# EAGLE design DOT-zero-SHIM (EAGLE 9.6.2)
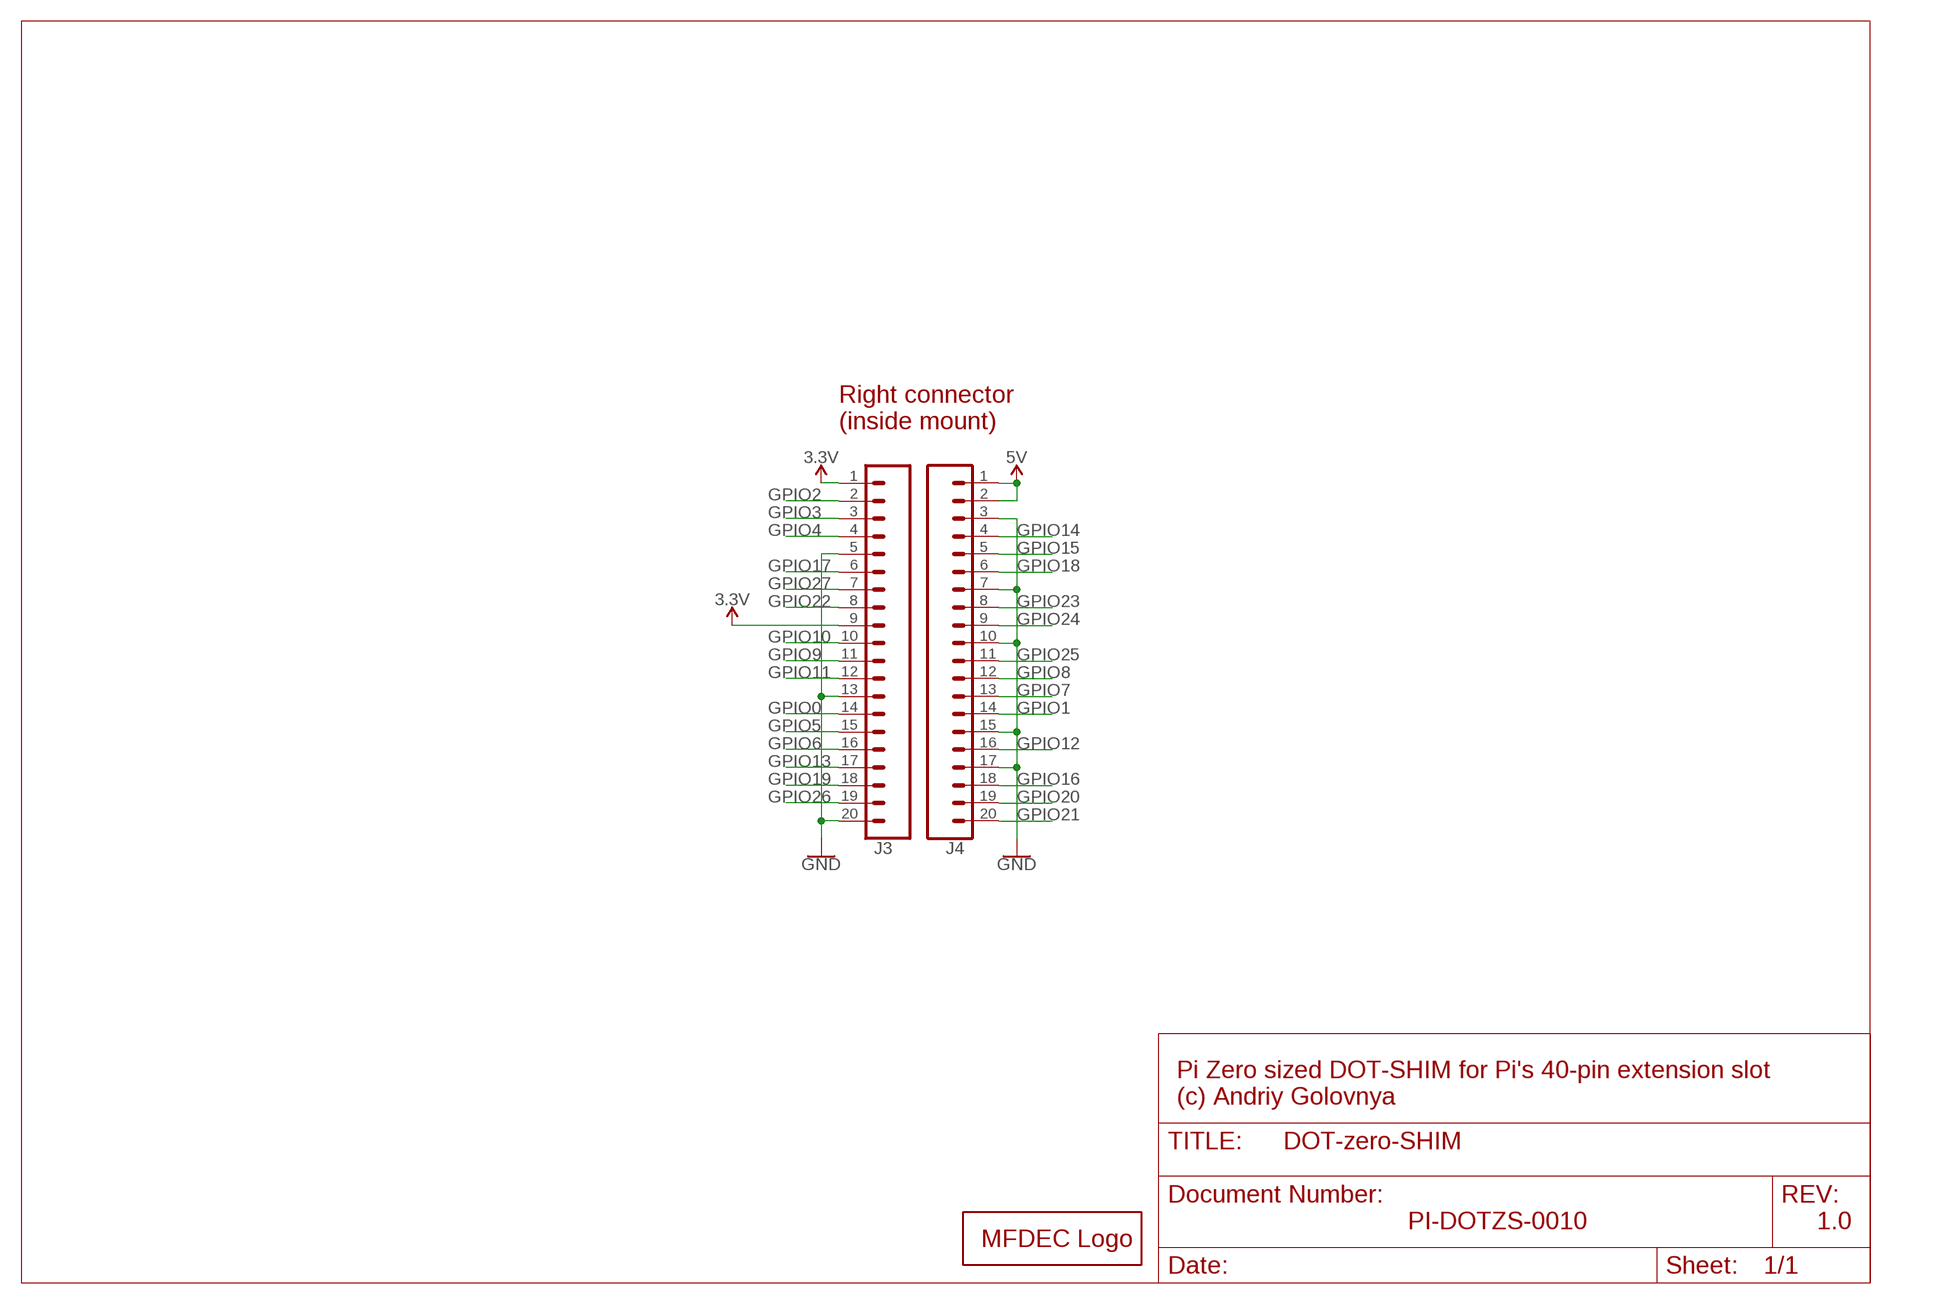
[diagram p0: schematic, sheet 1]

## Parts
J3  CONN_20LOCK  [1X20_LOCK]
J4  CONN_20LOCK  [1X20_LOCK]
LOGO1  MFDECLOGO_L_30MM  [MFDEC_L_30MM]

## Nets
3.3V: J3.1 J3.9
5V: J4.1 J4.2
GND: J3.5 J3.13 J3.20 J4.3 J4.7 J4.10 J4.15 J4.17
GPIO0: J3.14
GPIO1: J4.14
GPIO2: J3.2
GPIO3: J3.3
GPIO4: J3.4
GPIO5: J3.15
GPIO6: J3.16
GPIO7: J4.13
GPIO8: J4.12
GPIO9: J3.11
GPIO10: J3.10
GPIO11: J3.12
GPIO12: J4.16
GPIO13: J3.17
GPIO14: J4.4
GPIO15: J4.5
GPIO16: J4.18
GPIO17: J3.6
GPIO18: J4.6
GPIO19: J3.18
GPIO20: J4.19
GPIO21: J4.20
GPIO22: J3.8
GPIO23: J4.8
GPIO24: J4.9
GPIO25: J4.11
GPIO26: J3.19
GPIO27: J3.7

## Notes on the sheet
- Right connector
  (inside mount)
- Pi Zero sized DOT-SHIM for Pi's 40-pin extension slot
  (c) Andriy Golovnya
- PI-DOTZS-0010 | 1.0

## Library data of the parts
J3 J4 = _my_locked_connectors:CONN_20: Multi connection point. Often used as Generic Header-pin footprint for 0.1 inch spaced/style header connections On any of the 0.1 inch spaced packages, you can populate with these: Break Away Headers - Straight <https://www.sparkfun.com/products/116> (PRT-00116) Break Away Male Headers - Right Angle <https://www.sparkfun.com/products/553> (PRT-00553) Female Headers <https://www.sparkfun.com/products/115> (PRT-00115) Break Away Headers - Machine Pin <https://www.sparkfun.com/products/117> (PRT-00117) Break Away Female Headers - Swiss Machine Pin <https://www.sparkfun.com/products/743> (PRT-00743) For SCREWTERMINALS and SPRING TERMINALS visit here: Screw Terimnals on SparkFun.com <https://www.sparkfun.com/search/results?term=Screw+Terminals> (5mm/3.5mm/2.54mm spacing) This device is also useful as a general connection point to wire up your design to another part of your project. Our various solder wires solder well into these plated through hole pads. Hook-Up Wire - Assortment (Stranded, 22 AWG) <https://www.sparkfun.com/products/11375> (PRT-11375) Hook-Up Wire - Assortment (Solid Core, 22 AWG) <https://www.sparkfun.com/products/11367> (PRT-11367) View the entire wire category on our website here <https://www.sparkfun.com/categories/141> Special notes: Molex polarized connector foot print use with SKU : PRT-08231 with associated crimp pins and housings. 1MM SMD Version SKU: PRT-10208 NOTES ON THE VARIANTS LOCK and LOCK_LONGPADS... This footprint was designed to help hold the alignment of a through-hole component (i.e. 6-pin header) while soldering it into place. You may notice that each hole has been shifted either up or down by 0.005 of an inch from it's more standard position (which is a perfectly straight line). This slight alteration caused the pins (the squares in the middle) to touch the edges of the holes. Because they are alternating, it causes a "brace" to hold the component in place. 0.005 has proven to be the perfect amount of "off-center" position when using our standard breakaway headers. Although looks a little odd when you look at the bare footprint, once you have a header in there, the alteration is very hard to notice. Also,if you push a header all the way into place, it is covered up entirely on the bottom side. Note about LOCK SPECIAL package: This is just like the LOCK variant in that the holes are staggared by 5 mil, but except for the last two holes. They are not altered from the "standard" footprint layout. This is used for a special purpose on the layout of our Graphic LCD Backpack. Make sure you want to use this device before selecting it for you project!
LOGO1 = _my_logos:MFDECLOGO: Midnight Fog - Digital Eye Candy LOGO

## Board
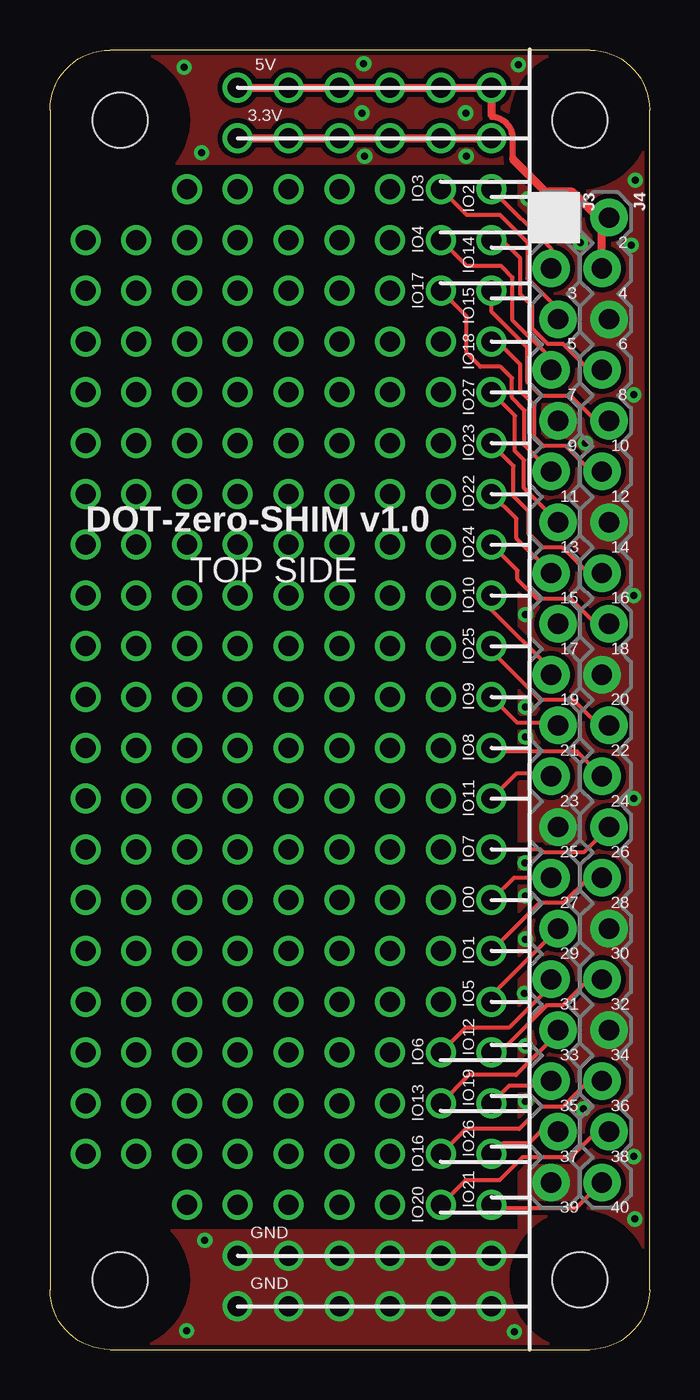
[diagram p1: board, top side]
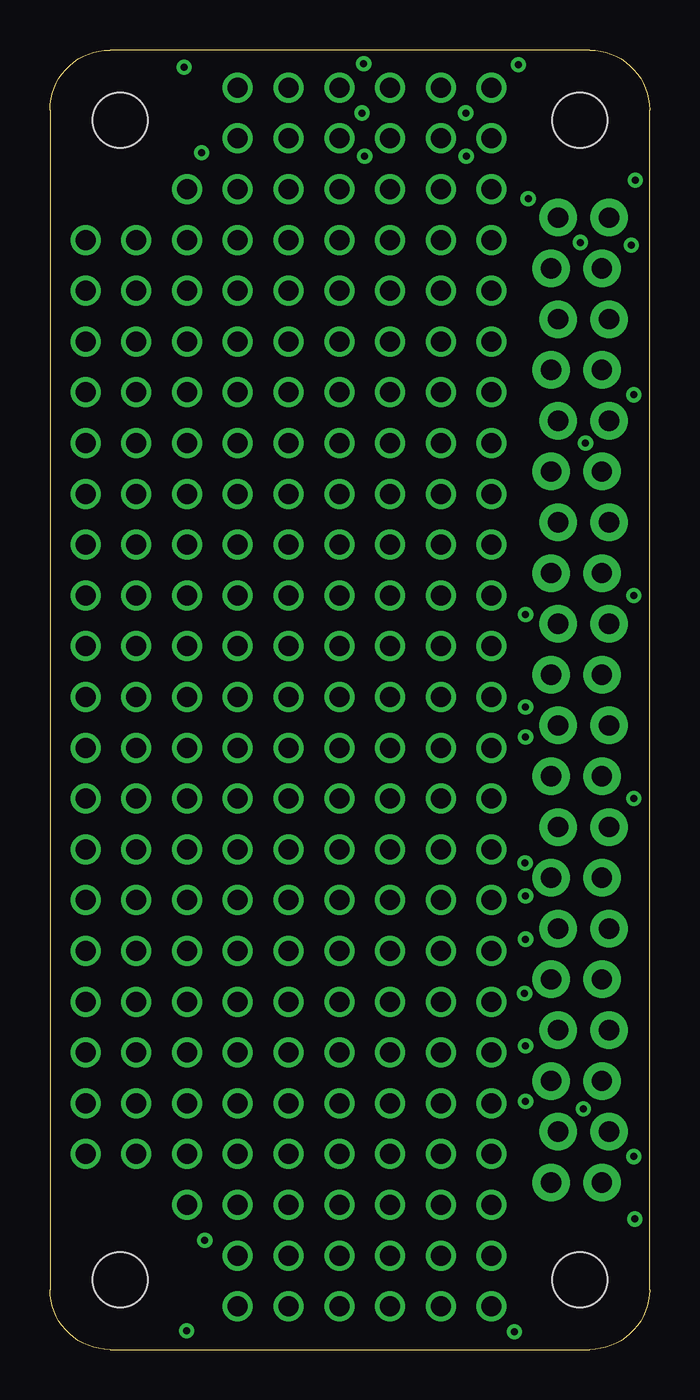
[diagram p2: board, inner layer Route2]
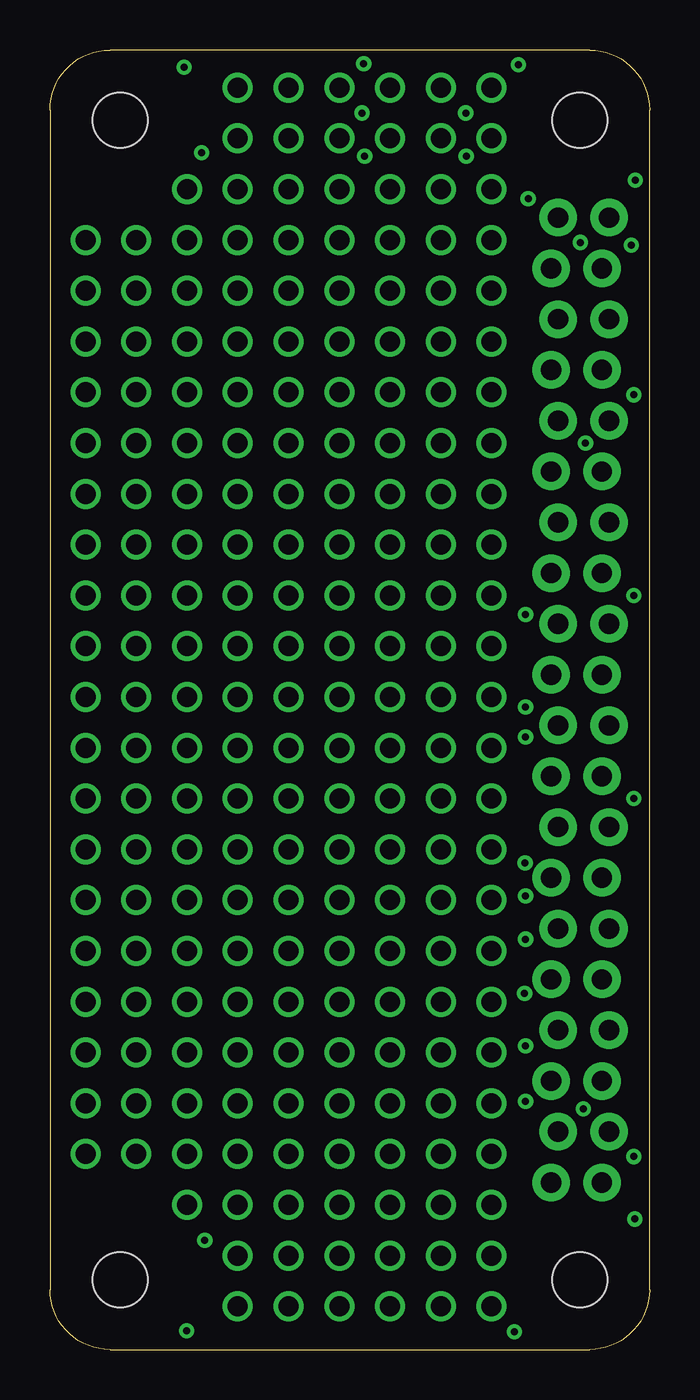
[diagram p3: board, inner layer Route15]
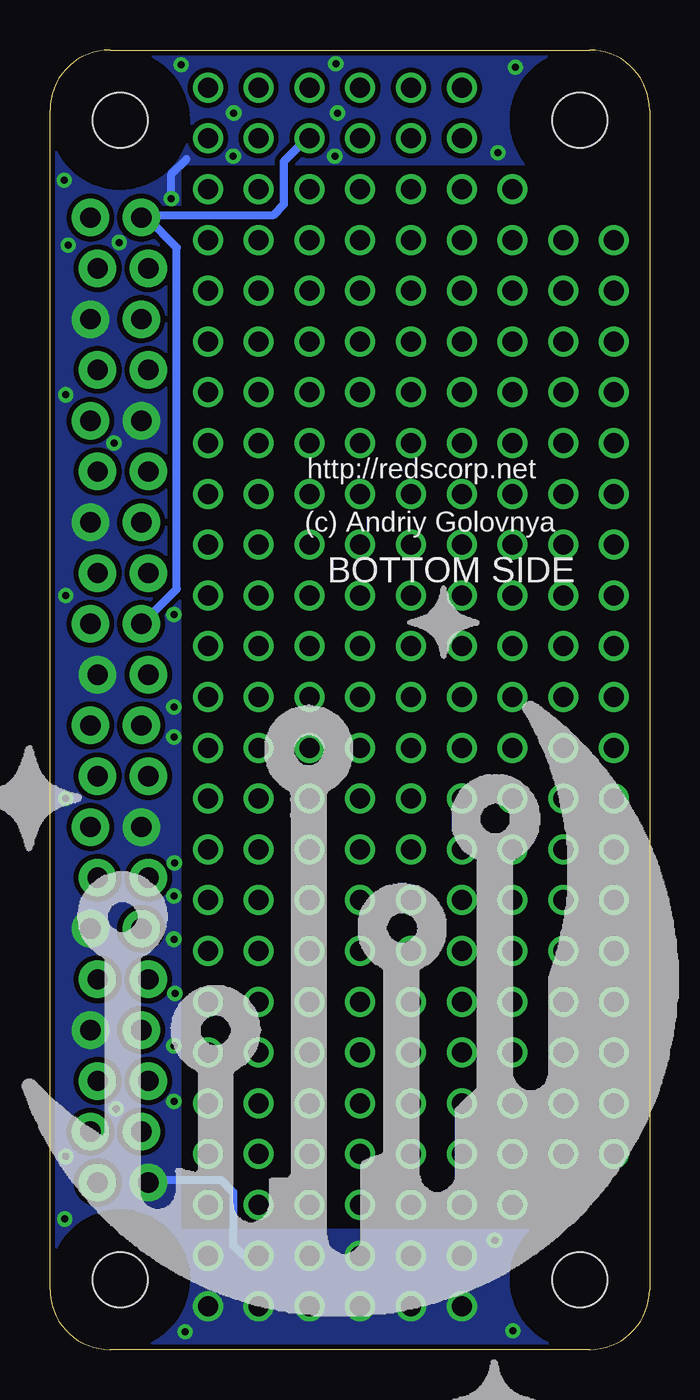
[diagram p4: board, bottom side, seen from below]

Size 30 x 65 mm. Coordinates in mm from the lower left corner, seen from the top.
Outline: 3,0 27,0 arc90 30,3 30,62 arc90 27,65 3,65 arc90 0,62 0,3 arc90 3,0
Copper layers (1*16): Top 0.035mm / dielectric 1.5mm / Bottom 0.035mm
Design rules "default *": minimum track width 6mil, minimum drill 0.35mm, track to track 6mil, track to pad 6mil, pad to pad 6mil, via to via 6mil, smd to smd 6mil, copper to edge 6mil, drill to drill 6mil, minimum pad ring 10mil, minimum via ring 8mil, stop-mask expansion 4mil, vias tented up to drill 20mil, thermal gap 10mil
Holes 2.75 mm at 3.5,3.5 26.5,3.5 3.5,61.5 26.5,61.5

### Footprints (pad centres in the part's own frame; a part is rotated, then mirrored left to right if it is on the bottom)
1X20_LOCK = drill 1.016 pad 1.88: 1 0,0.178; 2 2.54,-0.178; 3 5.08,0.178; 4 7.62,-0.178; 5 10.16,0.178; 6 12.7,-0.178; 7 15.24,0.178; 8 17.78,-0.178; 9 20.32,0.178; 10 22.86,-0.178; 11 25.4,0.178; 12 27.94,-0.178; 13 30.48,0.178; 14 33.02,-0.178; 15 35.56,0.178; 16 38.1,-0.178; 17 40.64,0.178; 18 43.18,-0.178; 19 45.72,0.178; 20 48.26,-0.178

### Placement (x,y rotation side)
J3  25.25,56.62 270 top
J4  27.79,56.62 270 top
LOGO1  -4.19,-7.11 90 bottom  (outside the outline)

### Tracks (layer width: path | path; a pad name or v marks a point on that pad's centre or on a via)
3.3V  (via drill 1)
  Top 0.406: v9.4,60.58 v11.94,60.58 v14.48,60.58 v17.02,60.58 v19.56,60.58 v22.1,60.58
  Bottom 0.406: J3.9 25.4,36.3 23.65,38.04 23.65,55.12 25.15,56.62 J3.1 25.3,56.74 18.82,56.74 18.29,57.28 18.29,59.44 17.14,60.58 v17.02,60.58
5V  (via drill 1)
  Top 0.305: 23.16,59.54 23.16,60.58 arc90 22.1,61.65 22.1,61.75
  Top 0.406: v9.4,63.12 v11.94,63.12 v14.48,63.12 v17.02,63.12 v19.56,63.12 v22.1,63.12 22.1,61.75 | J4.2 27.62,56.26 J4.1 27.44,56.62 26.14,57.91 24.79,57.91 23.16,59.54
GND  (via drill 0.35, 1)
  Bottom 0.406: J3.20 24.95,8.48 21.44,8.48 20.83,7.87 20.83,5.21 20.32,4.7 v19.56,4.7 | v23.93,57.56 23.93,58.78 23.16,59.54
  other vias: 22.1,4.7 17.02,4.7 14.48,4.7 11.94,4.7 9.4,4.7 9.4,2.16 11.94,2.16 14.48,2.16 17.02,2.16 19.56,2.16 22.1,2.16 7.75,5.46 6.83,0.94 29.26,6.53 23.24,0.89 7.59,59.87 6.71,64.14 23.44,64.26 29.29,58.5 20.83,59.69 20.8,61.85 15.75,59.69 15.62,61.85 15.7,64.31 23.8,36.75 23.8,30.63 23.8,22.68 23.8,20.52 23.8,15.19 26.54,55.37 26.8,45.34 26.7,12.04 29.08,55.24 29.21,47.75 29.21,37.72 29.21,27.56 29.21,9.65 23.8,32.13 23.77,24.33 23.75,17.81 23.8,12.42
  pour Top (isolate 0.254, no thermals): 23.5,59.31 0,59.31 0,65.15 30.23,65.15 30.23,0 0,0 0,5.97 23.5,5.97
  pour Bottom (isolate 0.254, no thermals): 0,59.31 0,65.15 30.23,65.15 30.23,0 0,0 0,5.97 23.5,5.97 23.5,59.31
GND1
  cutout Top: 26.5,0 arc-180 26.5,7 arc-180
  cutout Route2: 26.5,0 arc-180 26.5,7 arc-180
  cutout Route15: 26.5,0 arc-180 26.5,7 arc-180
  cutout Bottom: 26.5,0 arc-180 26.5,7 arc-180
GND2
  cutout Top: 3.5,58 arc-180 3.5,65 arc-180
  cutout Route2: 3.5,58 arc-180 3.5,65 arc-180
  cutout Route15: 3.5,58 arc-180 3.5,65 arc-180
  cutout Bottom: 3.5,58 arc-180 3.5,65 arc-180
GND3
  cutout Top: 26.5,58 arc-180 26.5,65 arc-180
  cutout Route2: 26.5,58 arc-180 26.5,65 arc-180
  cutout Route15: 26.5,58 arc-180 26.5,65 arc-180
  cutout Bottom: 26.5,58 arc-180 26.5,65 arc-180
GND4
  cutout Top: 3.5,0 arc-180 3.5,7 arc-180
  cutout Route2: 3.5,0 arc-180 3.5,7 arc-180
  cutout Route15: 3.5,0 arc-180 3.5,7 arc-180
  cutout Bottom: 3.5,0 arc-180 3.5,7 arc-180
GPIO0  (via drill 1)
  Top 0.203: J3.14 23.21,23.59 v22.1,22.48
GPIO1  (via drill 1)
  Top 0.203: J4.14 26.96,23.59 25.69,22.33 24.49,22.33 v22.1,19.94
GPIO2  (via drill 1)
  Top 0.203: v22.1,58.04 25.08,55.06 J3.2
GPIO3  (via drill 1)
  Top 0.203: v19.56,58.04 20.84,56.76 22.51,56.76 23.88,55.39 23.88,53.58 25.43,52.03 J3.3
GPIO4  (via drill 1)
  Top 0.203: J3.4 25.08,49.55 23.15,51.48 23.15,53.62 22.57,54.19 20.87,54.19 v19.56,55.5
GPIO5  (via drill 1)
  Top 0.203: J3.15 22.1,17.72 v22.1,17.4
GPIO6  (via drill 1)
  Top 0.203: J3.16 25.08,18.21 22.96,16.09 20.79,16.09 v19.56,14.86
GPIO7  (via drill 1)
  Top 0.203: v22.1,25.02 24.53,25.02 24.68,24.86 26.7,24.86 J4.13
GPIO8  (via drill 1)
  Top 0.203: v22.1,30.1 v22.1,30.09 22.27,29.92 26.37,29.92 J4.12
GPIO9  (via drill 1)
  Top 0.203: J3.11 25.3,31.34 23.39,31.34 v22.1,32.64
GPIO10  (via drill 1)
  Top 0.203: v22.1,37.72 22.1,36.99 25.08,34.01 J3.10
GPIO11  (via drill 1)
  Top 0.203: J3.12 24.95,28.8 23.34,28.8 v22.1,27.56
GPIO12  (via drill 1)
  Top 0.203: J4.16 26.96,18.52 25.66,17.22 24.86,17.22 22.5,14.86 v22.1,14.86
GPIO13  (via drill 1)
  Top 0.203: J3.17 25.43,15.85 23.31,13.73 20.97,13.73 v19.56,12.32
GPIO14  (via drill 1)
  Top 0.203: v22.1,55.5 22.61,55.5 23.53,54.58 23.53,52.8 24.13,52.2 24.13,51.07 24.91,50.29 25.69,50.29 26.98,48.99 J4.4
GPIO15  (via drill 1)
  Top 0.203: J4.5 27.31,46.45 26.07,47.7 24.58,47.7 23.88,48.4 23.88,50.12 22.1,51.9 v22.1,52.96
GPIO16  (via drill 1)
  Top 0.203: J4.18 26.96,13.44 25.66,12.14 24.58,12.14 23.48,11.04 20.82,11.04 v19.56,9.78
GPIO17  (via drill 1)
  Top 0.203: J3.6 23.75,45.24 23.75,46.97 23.11,47.61 23.11,48.59 22.54,49.16 21.53,49.16 20.84,49.85 20.84,51.68 v19.56,52.96
GPIO18  (via drill 1)
  Top 0.203: v22.1,50.42 22.38,50.42 23.52,49.28 23.52,47.96 24.24,47.24 24.24,45.63 24.68,45.19 25.81,45.19 27.08,43.91 J4.6
GPIO19  (via drill 1)
  Top 0.203: J3.18 24.82,13.18 22.97,13.18 v22.11,12.32 v22.1,12.32
GPIO20  (via drill 1)
  Top 0.203: J4.19 27.34,10.89 26.07,9.62 23.64,9.62 22.49,8.47 20.79,8.47 v19.56,7.24
GPIO21  (via drill 1)
  Top 0.203: v22.1,7.24 22.28,7.06 26.32,7.06 J4.20
GPIO22  (via drill 1)
  Top 0.203: J3.8 23.34,40.57 23.34,41.55 v22.1,42.8
GPIO23  (via drill 1)
  Top 0.203: J4.8 26.93,38.84 25.66,40.1 24.66,40.1 23.93,40.83 23.93,41.94 23.19,42.68 23.19,44.2 22.1,45.29 v22.1,45.34
GPIO24  (via drill 1)
  Top 0.203: J4.9 27.31,36.3 26.07,37.54 24.38,37.54 23.4,38.52 23.4,38.96 v22.1,40.26
GPIO25  (via drill 1)
  Top 0.203: J4.11 27.46,31.21 26.19,32.48 24.53,32.48 22.1,34.91 v22.1,35.17 v22.1,35.18
GPIO26  (via drill 1)
  Top 0.203: J3.19 24.54,10.89 23.95,10.31 22.63,10.31 v22.1,9.78
GPIO27  (via drill 1)
  Top 0.203: J3.7 23.72,43.08 23.72,44.48 23.27,44.94 23.27,46.71 v22.1,47.88
N$32  (via drill 1)
  other vias: 19.56,17.4
N$33  (via drill 1)
  other vias: 19.56,19.94
N$34  (via drill 1)
  other vias: 19.56,22.48
N$35  (via drill 1)
  other vias: 19.56,25.02
N$36  (via drill 1)
  other vias: 19.56,27.56
N$37  (via drill 1)
  other vias: 19.56,30.1
N$38  (via drill 1)
  other vias: 19.56,32.64
N$39  (via drill 1)
  other vias: 19.56,35.18
N$40  (via drill 1)
  other vias: 19.56,37.72
N$41  (via drill 1)
  other vias: 19.56,40.26
N$42  (via drill 1)
  other vias: 19.56,42.8
N$43  (via drill 1)
  other vias: 19.56,45.34
N$44  (via drill 1)
  other vias: 19.56,47.88
N$45  (via drill 1)
  other vias: 19.56,50.42
N$53  (via drill 1)
  other vias: 17.02,7.24
N$54  (via drill 1)
  other vias: 17.02,9.78
N$55  (via drill 1)
  other vias: 17.02,12.32
N$56  (via drill 1)
  other vias: 17.02,14.86
N$57  (via drill 1)
  other vias: 17.02,17.4
N$58  (via drill 1)
  other vias: 17.02,19.94
N$59  (via drill 1)
  other vias: 17.02,22.48
N$60  (via drill 1)
  other vias: 17.02,25.02
N$61  (via drill 1)
  other vias: 17.02,27.56
N$62  (via drill 1)
  other vias: 17.02,30.1
N$63  (via drill 1)
  other vias: 17.02,32.64
N$64  (via drill 1)
  other vias: 17.02,35.18
N$65  (via drill 1)
  other vias: 17.02,37.72
N$66  (via drill 1)
  other vias: 17.02,40.26
N$67  (via drill 1)
  other vias: 17.02,42.8
N$68  (via drill 1)
  other vias: 17.02,45.34
N$69  (via drill 1)
  other vias: 17.02,47.88
N$70  (via drill 1)
  other vias: 17.02,50.42
N$71  (via drill 1)
  other vias: 17.02,52.96
N$72  (via drill 1)
  other vias: 17.02,55.5
N$73  (via drill 1)
  other vias: 17.02,58.04
N$78  (via drill 1)
  other vias: 14.48,7.24
N$79  (via drill 1)
  other vias: 14.48,9.78
N$80  (via drill 1)
  other vias: 14.48,12.32
N$81  (via drill 1)
  other vias: 14.48,14.86
N$82  (via drill 1)
  other vias: 14.48,17.4
N$83  (via drill 1)
  other vias: 14.48,19.94
N$84  (via drill 1)
  other vias: 14.48,22.48
N$85  (via drill 1)
  other vias: 14.48,25.02
N$86  (via drill 1)
  other vias: 14.48,27.56
N$87  (via drill 1)
  other vias: 14.48,30.1
N$88  (via drill 1)
  other vias: 14.48,32.64
N$89  (via drill 1)
  other vias: 14.48,35.18
N$90  (via drill 1)
  other vias: 14.48,37.72
N$91  (via drill 1)
  other vias: 14.48,40.26
N$92  (via drill 1)
  other vias: 14.48,42.8
N$93  (via drill 1)
  other vias: 14.48,45.34
N$94  (via drill 1)
  other vias: 14.48,47.88
N$95  (via drill 1)
  other vias: 14.48,50.42
N$96  (via drill 1)
  other vias: 14.48,52.96
N$97  (via drill 1)
  other vias: 14.48,55.5
N$98  (via drill 1)
  other vias: 14.48,58.04
N$103  (via drill 1)
  other vias: 11.94,7.24
N$104  (via drill 1)
  other vias: 11.94,9.78
N$105  (via drill 1)
  other vias: 11.94,12.32
N$106  (via drill 1)
  other vias: 11.94,14.86
N$107  (via drill 1)
  other vias: 11.94,17.4
N$108  (via drill 1)
  other vias: 11.94,19.94
N$109  (via drill 1)
  other vias: 11.94,22.48
N$110  (via drill 1)
  other vias: 11.94,25.02
N$111  (via drill 1)
  other vias: 11.94,27.56
N$112  (via drill 1)
  other vias: 11.94,30.1
N$113  (via drill 1)
  other vias: 11.94,32.64
N$114  (via drill 1)
  other vias: 11.94,35.18
N$115  (via drill 1)
  other vias: 11.94,37.72
N$116  (via drill 1)
  other vias: 11.94,40.26
N$117  (via drill 1)
  other vias: 11.94,42.8
N$118  (via drill 1)
  other vias: 11.94,45.34
N$119  (via drill 1)
  other vias: 11.94,47.88
N$120  (via drill 1)
  other vias: 11.94,50.42
N$121  (via drill 1)
  other vias: 11.94,52.96
N$122  (via drill 1)
  other vias: 11.94,55.5
N$123  (via drill 1)
  other vias: 11.94,58.04
N$128  (via drill 1)
  other vias: 9.4,7.24
N$129  (via drill 1)
  other vias: 9.4,9.78
N$130  (via drill 1)
  other vias: 9.4,12.32
N$131  (via drill 1)
  other vias: 9.4,14.86
N$132  (via drill 1)
  other vias: 9.4,17.4
N$133  (via drill 1)
  other vias: 9.4,19.94
N$134  (via drill 1)
  other vias: 9.4,22.48
N$135  (via drill 1)
  other vias: 9.4,25.02
N$136  (via drill 1)
  other vias: 9.4,27.56
N$137  (via drill 1)
  other vias: 9.4,30.1
N$138  (via drill 1)
  other vias: 9.4,32.64
N$139  (via drill 1)
  other vias: 9.4,35.18
N$140  (via drill 1)
  other vias: 9.4,37.72
N$141  (via drill 1)
  other vias: 9.4,40.26
N$142  (via drill 1)
  other vias: 9.4,42.8
N$143  (via drill 1)
  other vias: 9.4,45.34
N$144  (via drill 1)
  other vias: 9.4,47.88
N$145  (via drill 1)
  other vias: 9.4,50.42
N$146  (via drill 1)
  other vias: 9.4,52.96
N$147  (via drill 1)
  other vias: 9.4,55.5
N$148  (via drill 1)
  other vias: 9.4,58.04
N$153  (via drill 1)
  other vias: 6.86,7.24
N$154  (via drill 1)
  other vias: 6.86,9.78
N$155  (via drill 1)
  other vias: 6.86,12.32
N$156  (via drill 1)
  other vias: 6.86,14.86
N$157  (via drill 1)
  other vias: 6.86,17.4
N$158  (via drill 1)
  other vias: 6.86,19.94
N$159  (via drill 1)
  other vias: 6.86,22.48
N$160  (via drill 1)
  other vias: 6.86,25.02
N$161  (via drill 1)
  other vias: 6.86,27.56
N$162  (via drill 1)
  other vias: 6.86,30.1
N$163  (via drill 1)
  other vias: 6.86,32.64
N$164  (via drill 1)
  other vias: 6.86,35.18
N$165  (via drill 1)
  other vias: 6.86,37.72
N$166  (via drill 1)
  other vias: 6.86,40.26
N$167  (via drill 1)
  other vias: 6.86,42.8
N$168  (via drill 1)
  other vias: 6.86,45.34
N$169  (via drill 1)
  other vias: 6.86,47.88
N$170  (via drill 1)
  other vias: 6.86,50.42
N$171  (via drill 1)
  other vias: 6.86,52.96
N$172  (via drill 1)
  other vias: 6.86,55.5
N$173  (via drill 1)
  other vias: 6.86,58.04
N$179  (via drill 1)
  other vias: 4.32,9.78
N$180  (via drill 1)
  other vias: 4.32,12.32
N$181  (via drill 1)
  other vias: 4.32,14.86
N$182  (via drill 1)
  other vias: 4.32,17.4
N$183  (via drill 1)
  other vias: 4.32,19.94
N$184  (via drill 1)
  other vias: 4.32,22.48
N$185  (via drill 1)
  other vias: 4.32,25.02
N$186  (via drill 1)
  other vias: 4.32,27.56
N$187  (via drill 1)
  other vias: 4.32,30.1
N$188  (via drill 1)
  other vias: 4.32,32.64
N$189  (via drill 1)
  other vias: 4.32,35.18
N$190  (via drill 1)
  other vias: 4.32,37.72
N$191  (via drill 1)
  other vias: 4.32,40.26
N$192  (via drill 1)
  other vias: 4.32,42.8
N$193  (via drill 1)
  other vias: 4.32,45.34
N$194  (via drill 1)
  other vias: 4.32,47.88
N$195  (via drill 1)
  other vias: 4.32,50.42
N$196  (via drill 1)
  other vias: 4.32,52.96
N$197  (via drill 1)
  other vias: 4.32,55.5
N$204  (via drill 1)
  other vias: 1.78,9.78
N$205  (via drill 1)
  other vias: 1.78,12.32
N$206  (via drill 1)
  other vias: 1.78,14.86
N$207  (via drill 1)
  other vias: 1.78,17.4
N$208  (via drill 1)
  other vias: 1.78,19.94
N$209  (via drill 1)
  other vias: 1.78,22.48
N$210  (via drill 1)
  other vias: 1.78,25.02
N$211  (via drill 1)
  other vias: 1.78,27.56
N$212  (via drill 1)
  other vias: 1.78,30.1
N$213  (via drill 1)
  other vias: 1.78,32.64
N$214  (via drill 1)
  other vias: 1.78,35.18
N$215  (via drill 1)
  other vias: 1.78,37.72
N$216  (via drill 1)
  other vias: 1.78,40.26
N$217  (via drill 1)
  other vias: 1.78,42.8
N$218  (via drill 1)
  other vias: 1.78,45.34
N$219  (via drill 1)
  other vias: 1.78,47.88
N$220  (via drill 1)
  other vias: 1.78,50.42
N$221  (via drill 1)
  other vias: 1.78,52.96
N$222  (via drill 1)
  other vias: 1.78,55.5

### Text on the board
tPlace: 5V | 3.3V | IO3 | IO2 | IO4 | 2 | IO14 | 3 | 4 | IO17 | IO15 | 5 | 6 | IO18 | IO27 | 7 | 8 | 9 | 10 | IO23 | IO22 | 11 | 12 | DOT-zero-SHIM v1.0 | 13 | 14 | IO24 | TOP SIDE | IO10 | 15 | 16 | 17 | 18 | IO25 | IO9 | 19 | 20 | 21 | 22 | IO8 | IO11 | 23 | 24 | 25 | 26 | IO7 | IO0 | 27 | 28 | 29 | 30 | IO1 | IO5 | 31 | 32 | IO12 | IO6 | 33 | 34 | IO19 | 35 | 36 | IO13 | IO26 | IO16 | 37 | 38 | IO21 | 39 | 40 | GND | IO20 | GND
bPlace: http://redscorp.net | (c) Andriy Golovnya | BOTTOM SIDE